# EAGLE schematic XPDR_Board_2 (EAGLE 7.2.0)
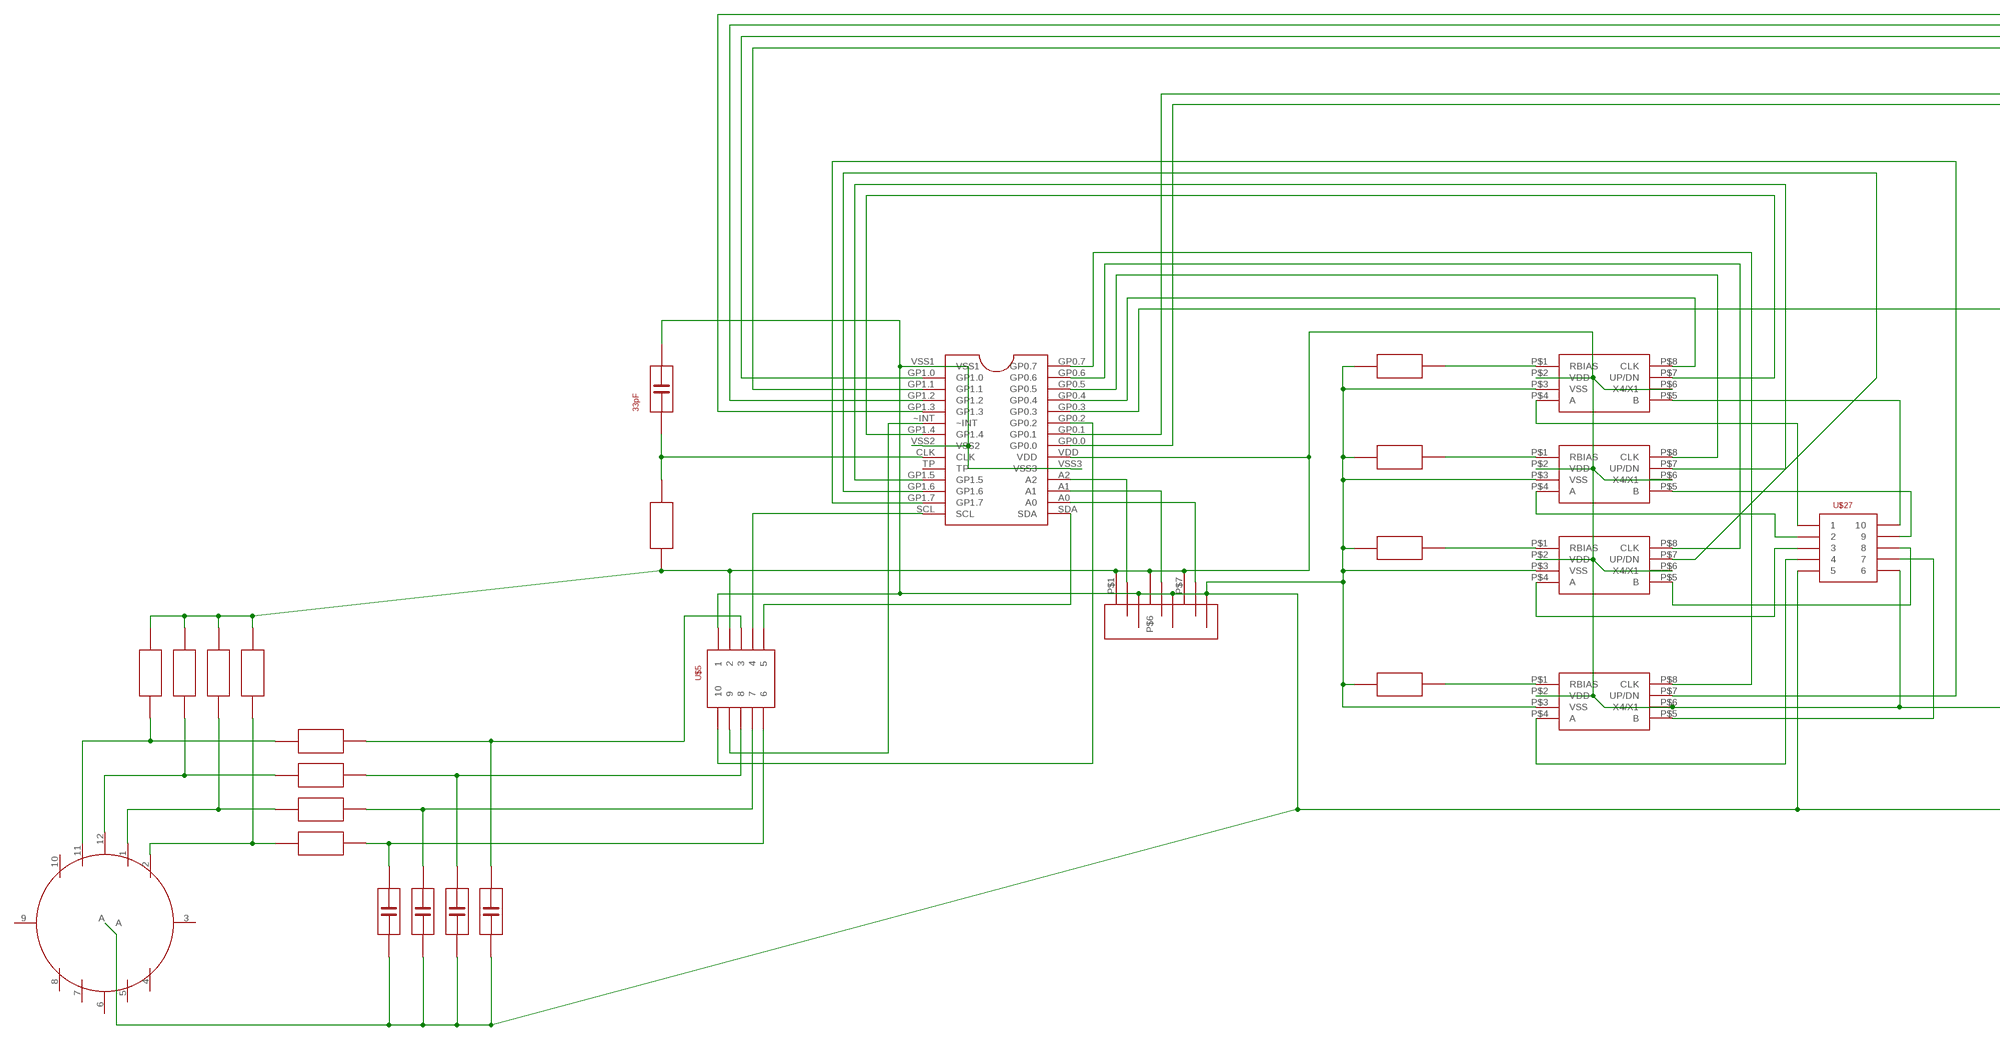
[diagram p0: schematic, sheet 1, part 1 of 2]
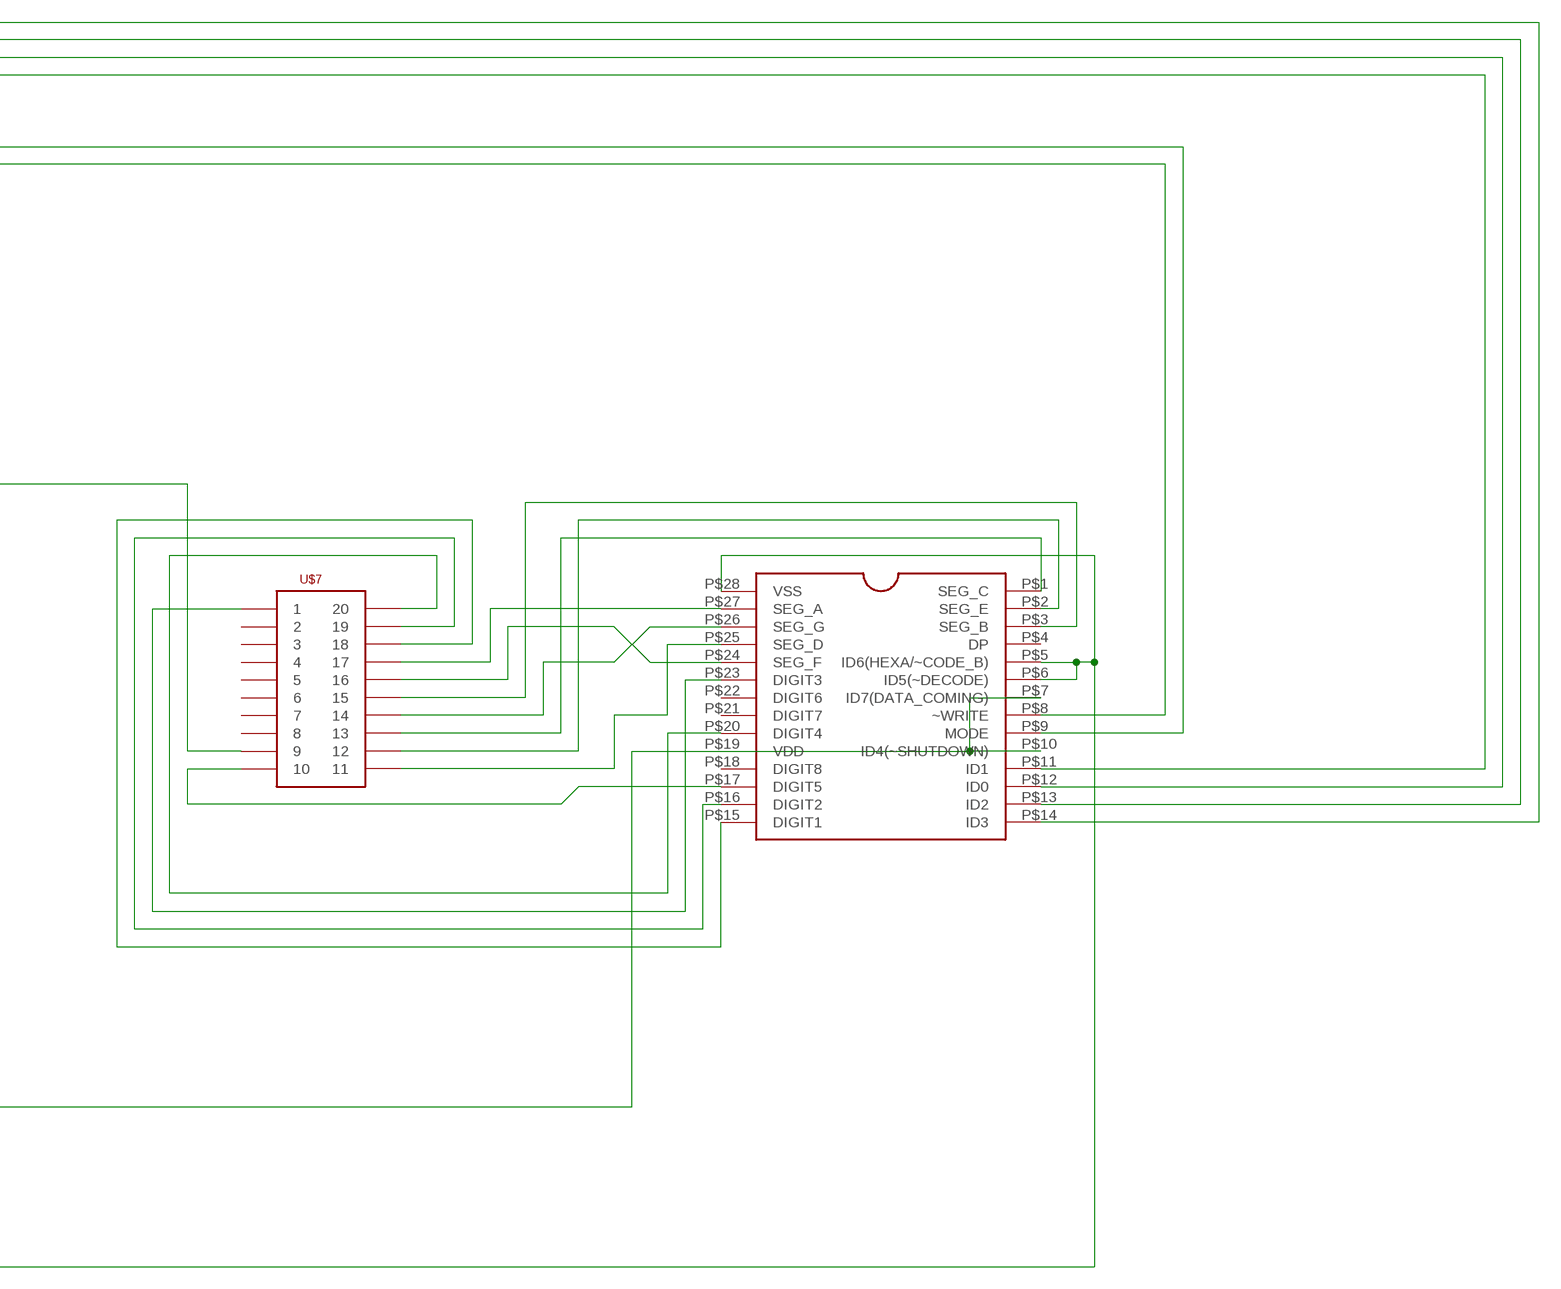
[diagram p1: schematic, sheet 1, part 2 of 2]

## Parts
U$1  LS7084  [LS7084]
U$2  LS7084  [LS7084]
U$3  LS7084  [LS7084]
U$4  LS7084  [LS7084]
U$5  LISTA_2X5  [LISTA_2X5]
U$6  ICM7228A  [ICM7228A]
U$7  LISTA_2X10  [LISTA_2X10]
U$8  470M  REZISTOR  [REZISTOR]
U$9  MCP23016  [MCP23016]
U$10  470M  REZISTOR  [REZISTOR]
U$11  ADRESA_0..2  [ADRESA_0..2]
U$12  470M  REZISTOR  [REZISTOR]
U$13  470M  REZISTOR  [REZISTOR]
U$14  3.9k  REZISTOR  [REZISTOR]
U$15  33pF  KONDENZATOR  [KONDENZATOR]
U$16  ROTARY_SWITCH  [ROTARY_SWITCH]
U$17  REZISTOR  [REZISTOR]
U$18  REZISTOR  [REZISTOR]
U$19  REZISTOR  [REZISTOR]
U$20  REZISTOR  [REZISTOR]
U$21  REZISTOR  [REZISTOR]
U$22  REZISTOR  [REZISTOR]
U$23  REZISTOR  [REZISTOR]
U$24  REZISTOR  [REZISTOR]
U$25  KONDENZATOR  [KONDENZATOR]
U$26  KONDENZATOR  [KONDENZATOR]
U$27  LISTA_2X5  [LISTA_2X5]
U$28  KONDENZATOR  [KONDENZATOR]
U$29  KONDENZATOR  [KONDENZATOR]

## Nets
GND: U$1.P$3(VSS) U$2.P$3(VSS) U$3.P$3(VSS) U$4.P$3(VSS) U$5.1 U$6.P$5(ID6(HEXA/~CODE_B)) U$6.P$6(ID5(~DECODE)) U$6.P$28(VSS) U$8.P$1 U$9.VSS1 U$9.VSS2 U$9.VSS3 U$10.P$1 U$11.P$3 U$11.P$4 U$11.P$9 U$12.P$1 U$13.P$1 U$15.P$2 U$16.A U$25.P$1 U$26.P$1 U$27.5 U$28.P$1 U$29.P$1
N$1: U$6.P$27(SEG_A) U$7.17
N$2: U$6.P$24(SEG_F) U$7.16
N$3: U$6.P$3(SEG_B) U$7.15
N$4: U$6.P$26(SEG_G) U$7.14
N$5: U$6.P$1(SEG_C) U$7.13
N$6: U$6.P$2(SEG_E) U$7.12
N$7: U$6.P$25(SEG_D) U$7.11
N$8: U$6.P$15(DIGIT1) U$7.18
N$9: U$6.P$16(DIGIT2) U$7.19
N$10: U$6.P$23(DIGIT3) U$7.1
N$11: U$6.P$20(DIGIT4) U$7.20
N$12: U$1.P$2(VDD) U$1.P$6(X4/X1) U$2.P$2(VDD) U$2.P$6(X4/X1) U$3.P$2(VDD) U$3.P$6(X4/X1) U$4.P$2(VDD) U$4.P$6(X4/X1) U$5.2 U$6.P$7(ID7(DATA_COMING)) U$6.P$10(ID4(~SHUTDOWN)) U$6.P$19(VDD) U$9.VDD U$11.P$1 U$11.P$6 U$11.P$7 U$14.P$1 U$17.P$1 U$18.P$1 U$19.P$1 U$20.P$1 U$27.6
N$13: U$6.P$12(ID0) U$9.GP1.0
N$14: U$1.P$8(CLK) U$9.GP0.4
N$15: U$2.P$8(CLK) U$9.GP0.5
N$16: U$1.P$1(RBIAS) U$8.P$2
N$17: U$2.P$1(RBIAS) U$10.P$2
N$18: U$3.P$1(RBIAS) U$12.P$2
N$19: U$4.P$1(RBIAS) U$13.P$2
N$20: U$6.P$11(ID1) U$9.GP1.1
N$21: U$3.P$8(CLK) U$9.GP0.6
N$22: U$4.P$8(CLK) U$9.GP0.7
N$23: U$1.P$7(UP/DN) U$9.GP1.4
N$24: U$1.P$4(A) U$27.1
N$25: U$1.P$5(B) U$27.10
N$26: U$2.P$4(A) U$27.2
N$27: U$2.P$5(B) U$27.9
N$28: U$3.P$4(A) U$27.3
N$29: U$3.P$5(B) U$27.8
N$30: U$4.P$4(A) U$27.4
N$31: U$4.P$5(B) U$27.7
N$32: U$2.P$7(UP/DN) U$9.GP1.5
N$33: U$3.P$7(UP/DN) U$9.GP1.6
N$34: U$4.P$7(UP/DN) U$9.GP1.7
N$35: U$9.A0 U$11.P$8
N$36: U$9.A1 U$11.P$5
N$37: U$9.A2 U$11.P$2
N$38: U$6.P$13(ID2) U$9.GP1.2
N$39: U$6.P$14(ID3) U$9.GP1.3
N$40: U$16.11 U$17.P$2 U$21.P$2
N$41: U$6.P$8(~WRITE) U$9.GP0.0
N$42: U$6.P$9(MODE) U$9.GP0.1
N$43: U$16.12 U$18.P$2 U$22.P$2
N$44: U$5.4 U$9.SCL
N$45: U$5.5 U$9.SDA
N$46: U$5.9 U$9.~INT
N$47: U$5.10 U$9.GP0.2
N$48: U$9.CLK U$14.P$2 U$15.P$1
N$49: U$7.9 U$9.GP0.3
N$50: U$6.P$17(DIGIT5) U$7.10
N$51: U$16.1 U$19.P$2 U$23.P$2
N$52: U$16.2 U$20.P$2 U$24.P$2
N$54: U$5.7 U$23.P$1 U$26.P$2
N$55: U$5.8 U$22.P$1 U$28.P$2
N$56: U$5.3 U$21.P$1 U$29.P$2
N$59: U$5.6 U$24.P$1 U$25.P$2
Unconnected: U$6.P$4(DP) U$6.P$18(DIGIT8) U$6.P$21(DIGIT7) U$6.P$22(DIGIT6) U$7.2 U$7.3 U$7.4 U$7.5 U$7.6 U$7.7 U$7.8 U$9.TP U$16.3 U$16.4 U$16.5 U$16.6 U$16.7 U$16.8 U$16.9 U$16.10

## Library data of the parts
U$1-U$4 = RadioStack_v2:LS7084
U$5 U$27 = RadioStack_v2:LISTA_2X5
U$6 = RadioStack_v2:ICM7228A
U$7 = RadioStack_v2:LISTA_2X10
U$8 U$10 U$12-U$14 U$17-U$24 = RadioStack_v2:REZISTOR
U$9 = RadioStack_v2:MCP23016
U$11 = RadioStack_v2:ADRESA_0..2
U$15 U$25 U$26 U$28 U$29 = RadioStack_v2:KONDENZATOR
U$16 = RadioStack_v2:ROTARY_SWITCH